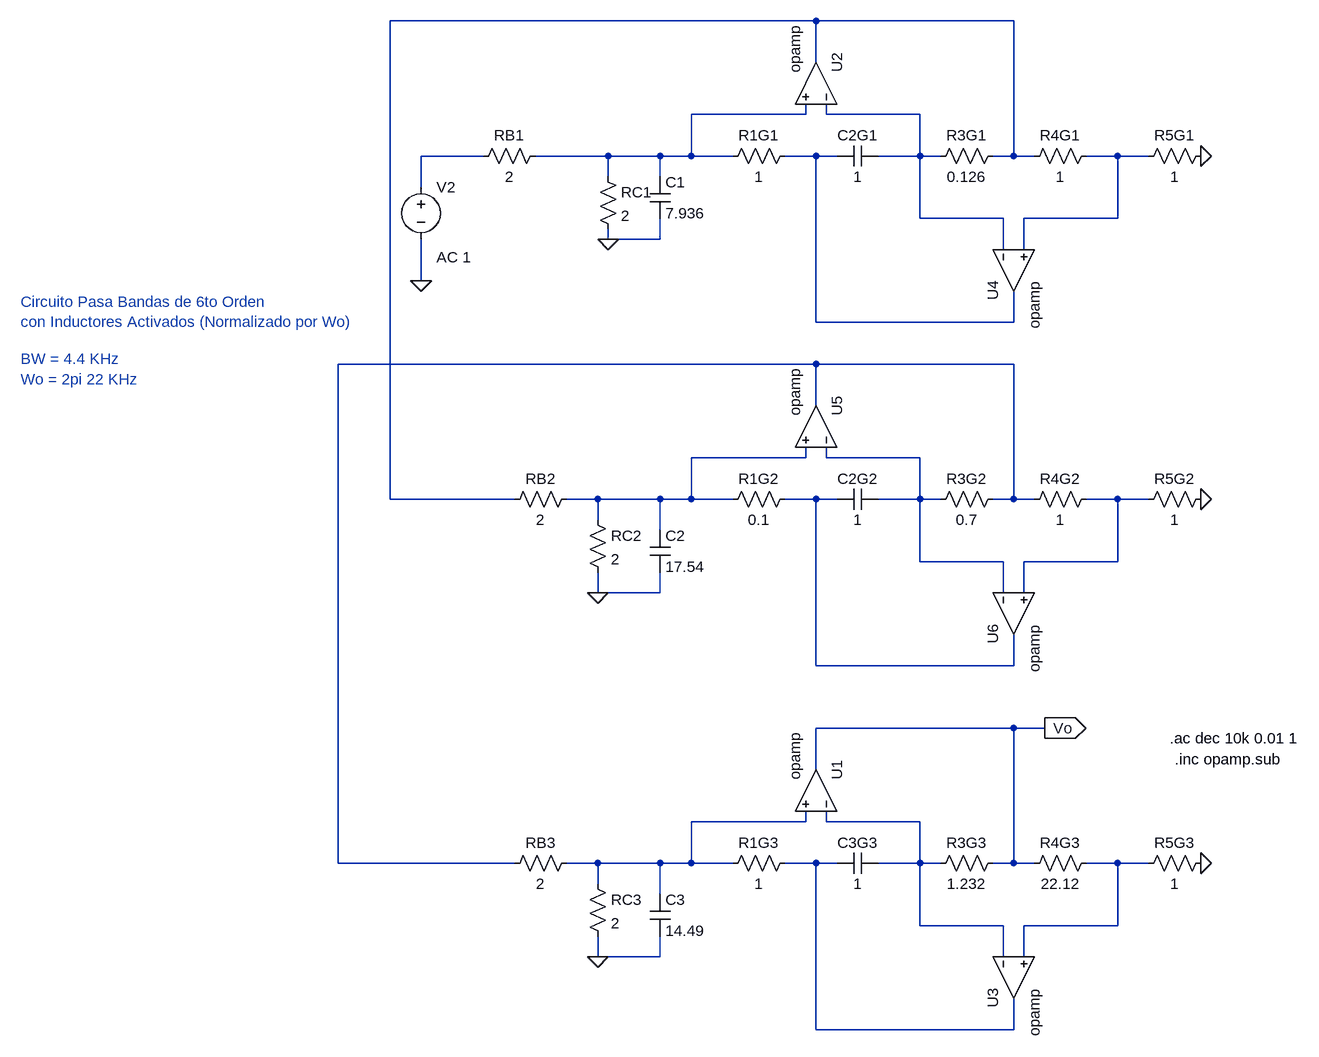
[diagram p0: schematic TS4-GIC.asc]
TS4-GIC.asc, the LTspice schematic file:
Version 4
SHEET 1 3096 1444
WIRE 1552 -112 896 -112
WIRE 1856 -112 1552 -112
WIRE 1552 -48 1552 -112
WIRE 1536 32 1536 16
WIRE 1536 32 1360 32
WIRE 1568 32 1568 16
WIRE 1712 32 1568 32
WIRE 1040 96 944 96
WIRE 1232 96 1120 96
WIRE 1312 96 1232 96
WIRE 1360 96 1360 32
WIRE 1360 96 1312 96
WIRE 1424 96 1360 96
WIRE 1552 96 1504 96
WIRE 1584 96 1552 96
WIRE 1712 96 1712 32
WIRE 1712 96 1648 96
WIRE 1744 96 1712 96
WIRE 1856 96 1856 -112
WIRE 1856 96 1824 96
WIRE 1888 96 1856 96
WIRE 2016 96 1968 96
WIRE 2064 96 2016 96
WIRE 1232 128 1232 96
WIRE 1312 128 1312 96
WIRE 944 144 944 96
WIRE 1712 192 1712 96
WIRE 1840 192 1712 192
WIRE 2016 192 2016 96
WIRE 2016 192 1872 192
WIRE 1232 224 1232 208
WIRE 1312 224 1312 192
WIRE 1312 224 1232 224
WIRE 1840 240 1840 192
WIRE 1872 240 1872 192
WIRE 944 288 944 224
WIRE 1552 352 1552 96
WIRE 1856 352 1856 304
WIRE 1856 352 1552 352
WIRE 1552 416 816 416
WIRE 1856 416 1552 416
WIRE 1552 480 1552 416
WIRE 1536 560 1536 544
WIRE 1536 560 1360 560
WIRE 1568 560 1568 544
WIRE 1712 560 1568 560
WIRE 896 624 896 -112
WIRE 1088 624 896 624
WIRE 1216 624 1168 624
WIRE 1312 624 1216 624
WIRE 1360 624 1360 560
WIRE 1360 624 1312 624
WIRE 1424 624 1360 624
WIRE 1552 624 1504 624
WIRE 1584 624 1552 624
WIRE 1712 624 1712 560
WIRE 1712 624 1648 624
WIRE 1744 624 1712 624
WIRE 1856 624 1856 416
WIRE 1856 624 1824 624
WIRE 1888 624 1856 624
WIRE 2016 624 1968 624
WIRE 2064 624 2016 624
WIRE 1216 656 1216 624
WIRE 1312 672 1312 624
WIRE 1712 720 1712 624
WIRE 1840 720 1712 720
WIRE 2016 720 2016 624
WIRE 2016 720 1872 720
WIRE 1216 768 1216 736
WIRE 1312 768 1312 736
WIRE 1312 768 1216 768
WIRE 1840 768 1840 720
WIRE 1872 768 1872 720
WIRE 1552 880 1552 624
WIRE 1856 880 1856 832
WIRE 1856 880 1552 880
WIRE 1856 976 1552 976
WIRE 1904 976 1856 976
WIRE 1552 1040 1552 976
WIRE 1536 1120 1536 1104
WIRE 1536 1120 1360 1120
WIRE 1568 1120 1568 1104
WIRE 1712 1120 1568 1120
WIRE 816 1184 816 416
WIRE 1088 1184 816 1184
WIRE 1216 1184 1168 1184
WIRE 1312 1184 1216 1184
WIRE 1360 1184 1360 1120
WIRE 1360 1184 1312 1184
WIRE 1424 1184 1360 1184
WIRE 1552 1184 1504 1184
WIRE 1584 1184 1552 1184
WIRE 1712 1184 1712 1120
WIRE 1712 1184 1648 1184
WIRE 1744 1184 1712 1184
WIRE 1856 1184 1856 976
WIRE 1856 1184 1824 1184
WIRE 1888 1184 1856 1184
WIRE 2016 1184 1968 1184
WIRE 2064 1184 2016 1184
WIRE 1216 1216 1216 1184
WIRE 1312 1232 1312 1184
WIRE 1712 1280 1712 1184
WIRE 1840 1280 1712 1280
WIRE 2016 1280 2016 1184
WIRE 2016 1280 1872 1280
WIRE 1216 1328 1216 1296
WIRE 1312 1328 1312 1296
WIRE 1312 1328 1216 1328
WIRE 1840 1328 1840 1280
WIRE 1872 1328 1872 1280
WIRE 1552 1440 1552 1184
WIRE 1856 1440 1856 1392
WIRE 1856 1440 1552 1440
FLAG 944 288 0
FLAG 2144 96 0
FLAG 2144 624 0
FLAG 1232 224 0
FLAG 1216 768 0
FLAG 2144 1184 0
FLAG 1216 1328 0
FLAG 1904 976 Vo
IOPIN 1904 976 Out
SYMBOL res 1136 80 R90
WINDOW 0 0 56 VBottom 2
WINDOW 3 32 56 VTop 2
SYMATTR InstName RB1
SYMATTR Value 2
SYMBOL res 1520 80 R90
WINDOW 0 0 56 VBottom 2
WINDOW 3 32 56 VTop 2
SYMATTR InstName R1G1
SYMATTR Value 1
SYMBOL cap 1648 80 R90
WINDOW 0 0 32 VBottom 2
WINDOW 3 32 32 VTop 2
SYMATTR InstName C2G1
SYMATTR Value 1
SYMBOL OpAmps\\opamp 1616 -16 M270
SYMATTR InstName U2
SYMATTR SpiceLine Aol=100000K
SYMATTR SpiceLine2 GBW=10000Meg
SYMBOL res 1840 80 R90
WINDOW 0 0 56 VBottom 2
WINDOW 3 32 56 VTop 2
SYMATTR InstName R3G1
SYMATTR Value 0.126
SYMBOL res 1984 80 R90
WINDOW 0 0 56 VBottom 2
WINDOW 3 32 56 VTop 2
SYMATTR InstName R4G1
SYMATTR Value 1
SYMBOL res 2160 80 R90
WINDOW 0 0 56 VBottom 2
WINDOW 3 32 56 VTop 2
SYMATTR InstName R5G1
SYMATTR Value 1
SYMBOL OpAmps\\opamp 1792 272 M90
SYMATTR InstName U4
SYMATTR SpiceLine Aol=100000K
SYMATTR SpiceLine2 GBW=10000Meg
SYMBOL res 1520 608 R90
WINDOW 0 0 56 VBottom 2
WINDOW 3 32 56 VTop 2
SYMATTR InstName R1G2
SYMATTR Value 0.1
SYMBOL cap 1648 608 R90
WINDOW 0 0 32 VBottom 2
WINDOW 3 32 32 VTop 2
SYMATTR InstName C2G2
SYMATTR Value 1
SYMBOL OpAmps\\opamp 1616 512 M270
SYMATTR InstName U5
SYMATTR SpiceLine Aol=100000K
SYMATTR SpiceLine2 GBW=10000Meg
SYMBOL res 1840 608 R90
WINDOW 0 0 56 VBottom 2
WINDOW 3 32 56 VTop 2
SYMATTR InstName R3G2
SYMATTR Value 0.7
SYMBOL res 1984 608 R90
WINDOW 0 0 56 VBottom 2
WINDOW 3 32 56 VTop 2
SYMATTR InstName R4G2
SYMATTR Value 1
SYMBOL res 2160 608 R90
WINDOW 0 0 56 VBottom 2
WINDOW 3 32 56 VTop 2
SYMATTR InstName R5G2
SYMATTR Value 1
SYMBOL OpAmps\\opamp 1792 800 M90
SYMATTR InstName U6
SYMATTR SpiceLine Aol=100000K
SYMATTR SpiceLine2 GBW=10000Meg
SYMBOL voltage 944 128 R0
WINDOW 123 24 124 Left 2
WINDOW 39 0 0 Left 0
SYMATTR Value2 AC 1
SYMATTR InstName V2
SYMATTR Value ""
SYMBOL cap 1296 128 R0
SYMATTR InstName C1
SYMATTR Value 7.936
SYMBOL res 1216 112 R0
SYMATTR InstName RC1
SYMATTR Value 2
SYMBOL res 1200 640 R0
SYMATTR InstName RC2
SYMATTR Value 2
SYMBOL cap 1296 672 R0
SYMATTR InstName C2
SYMATTR Value 17.54
SYMBOL res 1184 608 R90
WINDOW 0 0 56 VBottom 2
WINDOW 3 32 56 VTop 2
SYMATTR InstName RB2
SYMATTR Value 2
SYMBOL res 1520 1168 R90
WINDOW 0 0 56 VBottom 2
WINDOW 3 32 56 VTop 2
SYMATTR InstName R1G3
SYMATTR Value 1
SYMBOL cap 1648 1168 R90
WINDOW 0 0 32 VBottom 2
WINDOW 3 32 32 VTop 2
SYMATTR InstName C3G3
SYMATTR Value 1
SYMBOL OpAmps\\opamp 1616 1072 M270
SYMATTR InstName U1
SYMATTR SpiceLine Aol=100000K
SYMATTR SpiceLine2 GBW=10000Meg
SYMBOL res 1840 1168 R90
WINDOW 0 0 56 VBottom 2
WINDOW 3 32 56 VTop 2
SYMATTR InstName R3G3
SYMATTR Value 1.232
SYMBOL res 1984 1168 R90
WINDOW 0 0 56 VBottom 2
WINDOW 3 32 56 VTop 2
SYMATTR InstName R4G3
SYMATTR Value 22.12
SYMBOL res 2160 1168 R90
WINDOW 0 0 56 VBottom 2
WINDOW 3 32 56 VTop 2
SYMATTR InstName R5G3
SYMATTR Value 1
SYMBOL OpAmps\\opamp 1792 1360 M90
SYMATTR InstName U3
SYMATTR SpiceLine Aol=100000K
SYMATTR SpiceLine2 GBW=10000Meg
SYMBOL res 1200 1200 R0
SYMATTR InstName RC3
SYMATTR Value 2
SYMBOL cap 1296 1232 R0
SYMATTR InstName C3
SYMATTR Value 14.49
SYMBOL res 1184 1168 R90
WINDOW 0 0 56 VBottom 2
WINDOW 3 32 56 VTop 2
SYMATTR InstName RB3
SYMATTR Value 2
TEXT 328 320 Left 2 ;Circuito Pasa Bandas de 6to Orden\ncon Inductores Activados (Normalizado por Wo)
TEXT 2096 992 Left 2 !.ac dec 10k 0.01 1
TEXT 2104 1024 Left 2 !.inc opamp.sub
TEXT 328 408 Left 2 ;BW = 4.4 KHz\nWo = 2pi 22 KHz

The netlist it stands for:
* TS4-GIC.asc
RB1 N002 N004 2
R1G1 N005 N002 1
C2G1 N003 N005 1
XU2 N003 N002 N001 opamp Aol=100000K GBW=10000Meg  ; pins invin noninvin out
R3G1 N001 N003 0.126
R4G1 N006 N001 1
R5G1 0 N006 1
XU4 N003 N006 N005 opamp Aol=100000K GBW=10000Meg  ; pins invin noninvin out
R1G2 N010 N008 0.1
C2G2 N009 N010 1
XU5 N009 N008 N007 opamp Aol=100000K GBW=10000Meg  ; pins invin noninvin out
R3G2 N007 N009 0.7
R4G2 N011 N007 1
R5G2 0 N011 1
XU6 N009 N011 N010 opamp Aol=100000K GBW=10000Meg  ; pins invin noninvin out
V2 N004 0 AC 1
C1 N002 0 7.936
RC1 N002 0 2
RC2 N008 0 2
C2 N008 0 17.54
RB2 N008 N001 2
R1G3 N014 N012 1
C3G3 N013 N014 1
XU1 N013 N012 Vo opamp Aol=100000K GBW=10000Meg  ; pins invin noninvin out
R3G3 Vo N013 1.232
R4G3 N015 Vo 22.12
R5G3 0 N015 1
XU3 N013 N015 N014 opamp Aol=100000K GBW=10000Meg  ; pins invin noninvin out
RC3 N012 0 2
C3 N012 0 14.49
RB3 N012 N007 2
* Circuito Pasa Bandas de 6to Orden
* con Inductores Activados (Normalizado por Wo)
.ac dec 10k 0.01 1
.inc opamp.sub
* BW = 4.4 KHz
* Wo = 2pi 22 KHz
.backanno
.end